# EasyEDA Pro project ProPrj_Summer Robot_2025-12-26-22-22-15.epro

# Schematic Motor Control Unit
Board Name: Motor Control Unit; Create Date: 2025-05-18; Page Name: P1; Project Name: Summer Robot; Schematic Name: Motor Control Unit; Update Date: 2025-05-18; Company: Ethan Reynolds; Drawn: 2025-05-17; Page Size: A4; Version: V1.0
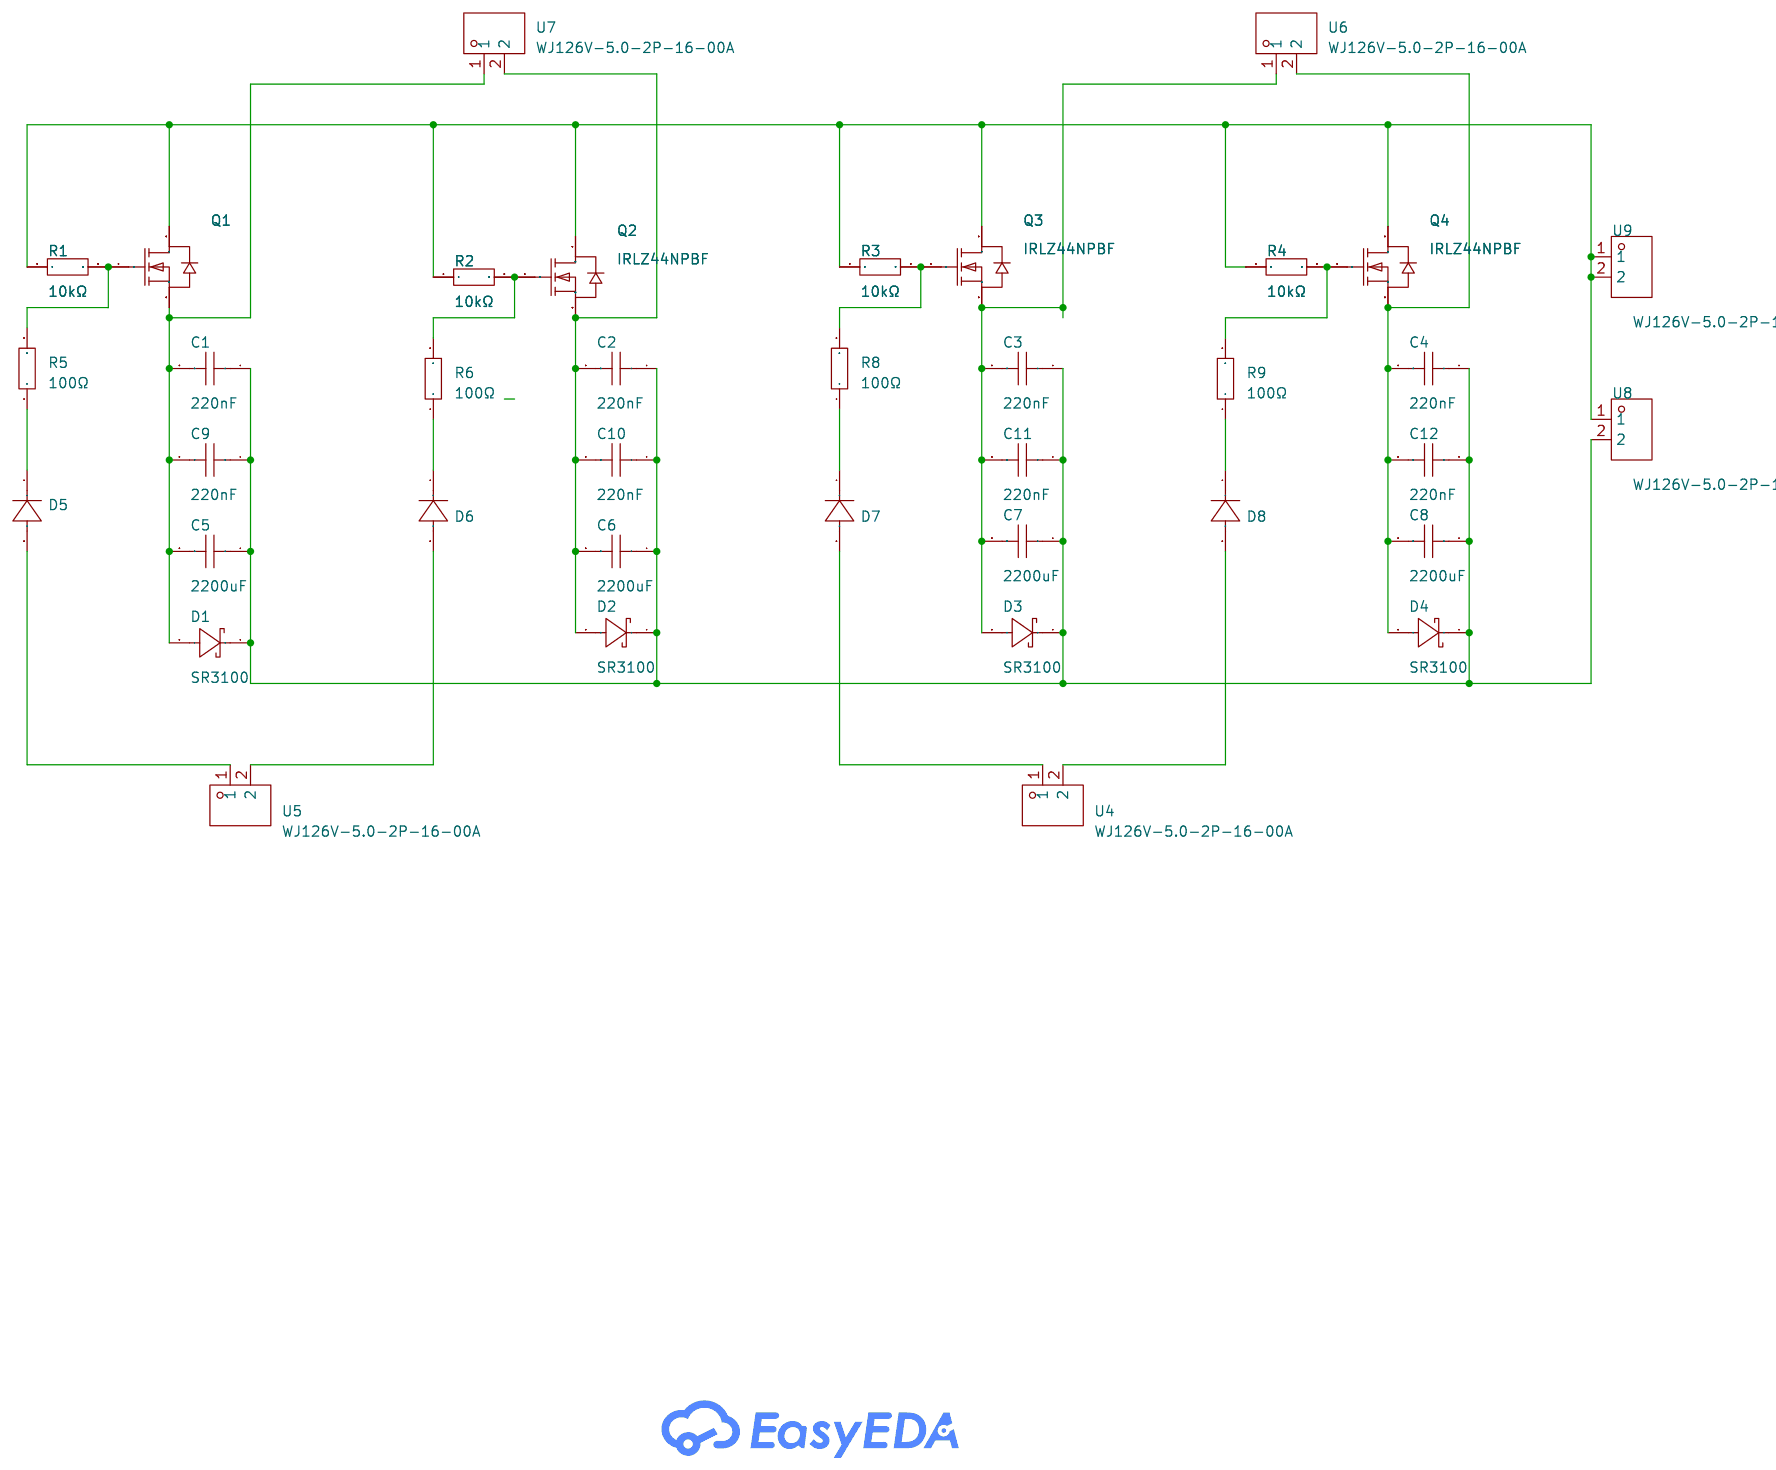
[diagram p0: schematic sheet]

## Parts
C1  220nF  [CAP-TH_L10.0-W2.7-P7.80-D0.4]
C2  220nF  [CAP-TH_L10.0-W2.7-P7.80-D0.4]
C3  220nF  [CAP-TH_L10.0-W2.7-P7.80-D0.4]
C4  220nF  [CAP-TH_L10.0-W2.7-P7.80-D0.4]
C5  2200uF  [CAP-TH_BD10.0-P5.00-D0.6-FD]
C6  2200uF  [CAP-TH_BD10.0-P5.00-D0.6-FD]
C7  2200uF  [CAP-TH_BD10.0-P5.00-D0.6-FD]
C8  2200uF  [CAP-TH_BD10.0-P5.00-D0.6-FD]
C9  220nF  [CAP-TH_L10.0-W2.7-P7.80-D0.4]
C10  220nF  [CAP-TH_L10.0-W2.7-P7.80-D0.4]
C11  220nF  [CAP-TH_L10.0-W2.7-P7.80-D0.4]
C12  220nF  [CAP-TH_L10.0-W2.7-P7.80-D0.4]
D1  SR3100  [DO-201AD_BD5.3-L8.4-P12.50-D1.4-RD]
D2  SR3100  [DO-201AD_BD5.3-L8.4-P12.50-D1.4-RD]
D3  SR3100  [DO-201AD_BD5.3-L8.4-P12.50-D1.4-RD]
D4  SR3100  [DO-201AD_BD5.3-L8.4-P12.50-D1.4-RD]
D5  -  [DO-41_BD2.4-L4.7-P8.70-D0.9-RD]
D6  -  [DO-41_BD2.4-L4.7-P8.70-D0.9-RD]
D7  -  [DO-41_BD2.4-L4.7-P8.70-D0.9-RD]
D8  -  [DO-41_BD2.4-L4.7-P8.70-D0.9-RD]
Q1  IRLZ44NPBF  [TO-220-3_L10.0-W4.5-P2.54-T]
Q2  IRLZ44NPBF  [TO-220-3_L10.0-W4.5-P2.54-T]
Q3  IRLZ44NPBF  [TO-220-3_L10.0-W4.5-P2.54-T]
Q4  IRLZ44NPBF  [TO-220-3_L10.0-W4.5-P2.54-T]
R1  10kΩ  [RES-TH_BD2.4-L6.3-P10.30-D0.6]
R2  10kΩ  [RES-TH_BD2.4-L6.3-P10.30-D0.6]
R3  10kΩ  [RES-TH_BD2.4-L6.3-P10.30-D0.6]
R4  10kΩ  [RES-TH_BD2.4-L6.3-P10.30-D0.6]
R5  100Ω  [RES-TH_BD4.0-L11.5-P15.50-D0.7]
R6  100Ω  [RES-TH_BD4.0-L11.5-P15.50-D0.7]
R8  100Ω  [RES-TH_BD4.0-L11.5-P15.50-D0.7]
R9  100Ω  [RES-TH_BD4.0-L11.5-P15.50-D0.7]
U4  WJ126V-5.0-2P-16-00A  [CONN-TH_WJ126V-5.0-2P]
U5  WJ126V-5.0-2P-16-00A  [CONN-TH_WJ126V-5.0-2P]
U6  WJ126V-5.0-2P-16-00A  [CONN-TH_WJ126V-5.0-2P]
U7  WJ126V-5.0-2P-16-00A  [CONN-TH_WJ126V-5.0-2P]
U8  WJ126V-5.0-2P-16-00A  [CONN-TH_WJ126V-5.0-2P]
U9  WJ126V-5.0-2P-16-00A  [CONN-TH_WJ126V-5.0-2P]

## Library data of the parts
C1-C4 C9-C12 = MPE224J100V82CL0045: Capacitance:220nF Tolerance:±5% Tolerance:±5% Voltage Rated: Dielectric Material:Metallized Polyester Operating Temperature:-55℃~+85℃ Operating Temperature:-55℃~+85℃; LCSC Part Name: 220nF ±5% 100V; Supplier Part: C2803185; Manufacturer: KNSCHA(科尼盛); Supplier Footprint: 插件,P=5mm; JLCPCB Part Class: Extended Part; Datasheet: https://atta.szlcsc.com/upload/public/pdf/source/20210420/C2803185_E3321C8762E86646BB5DB6CDE5AB9948.pdf; Supplier: LCSC; Tolerance: ±5%; Dielectric Material: Metallized Polyester; Operating Temperature: -55℃~+85℃
C5-C8 = EKZE160ELL222MJ25S: Capacitance: Tolerance:±20% Tolerance:±20% Rated Voltage: Ripple Current:- Equivalent Series Resistance(ESR):- Lead Spacing: φD: L: Lifetime @ Temp:5000hrs@105℃; LCSC Part Name: 2200uF ±20% 16V; Supplier Part: C320010; Manufacturer: NCC(日本贵弥功); Supplier Footprint: 插件,D10xL25mm; JLCPCB Part Class: Extended Part; Datasheet: https://atta.szlcsc.com/upload/public/pdf/source/20190311/C320010_4ADC44D1D3213EF7D3C5B91987F675CC.pdf; Supplier: LCSC; Tolerance: ±20%; Lifetime @ Temp: 5000hrs@105℃
D1-D4 = SR3100_C698900: Diode Configuration:Independent Type Voltage - Forward(Vf@If):850mV@3A Voltage - DC Reverse(Vr):100V Current - Rectified:3A Reverse Leakage Current (Ir):100uA@100V; LCSC Part Name: 电压:100V 电流:3A; Supplier Part: C698900; Manufacturer: YANGJIE(扬杰); Supplier Footprint: DO-27; JLCPCB Part Class: Extended Part; Datasheet: https://atta.szlcsc.com/upload/public/pdf/source/20200709/C698900_6D78AD0DF45561612416347AC03E8208.pdf; Supplier: LCSC; Diode Configuration: Independent Type; Voltage - Forward(Vf@If): 850mV@3A; Voltage - DC Reverse(Vr): 100V; Current - Rectified: 3A; Reverse Leakage Current (Ir): 100uA@100V
D5-D8 = 1N4007: Supplier Footprint: DO-41
Q1-Q4 = IRLZ44NPBF: Type:1 N-Channel Drain Source Voltage (Vdss): Continuous Drain Current (Id): Drain Source On Resistance (RDS(on)@Vgs,Id):0.025Ω@5.0V,25A Power Dissipation (Pd): Gate Threshold Voltage (Vgs(th)@Id):1V@250uA Total Gate Charge (Qg@Vgs):48nC Input Capacitance; LCSC Part Name: 1个N沟道 耐压:55V 电流:47A; Supplier Part: C38774; Manufacturer: Infineon(英飞凌); Supplier Footprint: TO-220AB; JLCPCB Part Class: Extended Part; Datasheet: https://atta.szlcsc.com/upload/public/pdf/source/20141125/1457707250505.pdf; Supplier: LCSC; Type: 1 N-Channel; Drain Source On Resistance (RDS(on)@Vgs,Id): 0.025Ω@5.0V,25A; Gate Threshold Voltage (Vgs(th)@Id): 1V@250uA; Total Gate Charge (Qg@Vgs): 48nC; Input Capacitance (Ciss@Vds): 1.7nF; Reverse Transfer Capacitance (Crss@Vds): 150pF; Operating Temperature: -55℃~+175℃
R1-R4 = RN1/4W10KFT/BA1: Type:Metal Film Resistors Resistance:10kΩ Tolerance:±1% Tolerance:±1% Voltage-Supply(Max):250V Power(Watts):1/4W Temperature Coefficient:±50ppm/℃ Temperature Coefficient:±50ppm/℃ Operating Temperature:-55℃~+125℃ Operating Temperature:-55℃~+125℃; LCSC Part Name: 10kΩ ±1% 250mW 金属膜电阻; Supplier Part: C410695; Manufacturer: Tyohm(幸亚电阻); Supplier Footprint: 插件,D2.4xL6.5mm; JLCPCB Part Class: Extended Part; Datasheet: https://atta.szlcsc.com/upload/public/pdf/source/20250211/2C0505E212032D72CE625B2E6B5197BA.pdf; Supplier: LCSC; Type: Metal Film Resistors; Tolerance: ±1%; Voltage-Supply(Max): 250V; Power(Watts): 1/4W; Temperature Coefficient: ±50ppm/℃; Operating Temperature: -55℃~+125℃
R5 R6 R8 R9 = MF1W-100Ω±1% T: Type:Metal Film Resistors Resistance: Tolerance:±1% Tolerance:±1% Voltage-Supply(Max):350V Power(Watts):1W Temperature Coefficient:±100ppm/℃ Temperature Coefficient:±100ppm/℃ Operating Temperature:-55℃~+155℃ Operating Temperature:-55℃~+155℃; LCSC Part Name: 100Ω ±1% 1W 金属膜电阻; Supplier Part: C119469; Manufacturer: CCO(千志电子); Supplier Footprint: 插件,D4.5xL11.5mm; JLCPCB Part Class: Extended Part; Datasheet: https://atta.szlcsc.com/upload/public/pdf/source/20190910/C427326_62A6D058BC0FF74963A2F22379CA06CE.pdf; Supplier: LCSC; Type: Metal Film Resistors; Tolerance: ±1%; Voltage-Supply(Max): 350V; Power(Watts): 1W; Temperature Coefficient: ±100ppm/℃; Operating Temperature: -55℃~+155℃
U4-U9 = WJ126V-5.0-2P-16-00A: LCSC Part Name: 直插式/5.0mm 2P 红色; Supplier Part: C3031437; Manufacturer: KANGNEX(康奈克斯电气); Supplier Footprint: P=5mm; JLCPCB Part Class: Extended Part; Datasheet: https://atta.szlcsc.com/upload/public/pdf/source/20191225/C8379_3D37D98EF6F0ECCD8D2EB72C93E46299.pdf; Supplier: LCSC

## Nets
$1N1159: Q1.2(D) Q2.2(D) Q3.2(D) Q4.2(D) R1.1 R2.1 R3.1 R4.1 U8.1 U9.1 U9.2
$1N1315: Q4.1(G) R4.2 R9.2
$1N1376: D8.1(K) R9.1
$1N1382: Q3.1(G) R3.2 R8.2
$1N1384: Q2.1(G) R2.2 R6.2
$1N1386: Q1.1(G) R1.2 R5.2
$1N1420: C4.2 C8.2 C12.2 D4.2(A) Q4.3(S) U6.2
$1N1432: D8.2(A) U4.2
$1N1435: C3.2 C7.2 C11.2 D3.2(A) Q3.3(S) U6.1
$1N1443: D7.1(K) R8.1
$1N1558: C2.2 C6.2 C10.2 D2.2(A) Q2.3(S) U7.2
$1N1571: D6.1(K) R6.1
$1N1599: C1.2 C5.2 C9.2 D1.2(A) Q1.3(S) U7.1
$1N1611: D5.1(K) R5.1
$1N2155: D5.2(A) U5.1
$1N2160: D6.2(A) U5.2
$1N2166: D7.2(A) U4.1
$1N6815: C1.1 C2.1 C3.1 C4.1 C5.1 C6.1 C7.1 C8.1 C9.1 C10.1 C11.1 C12.1 D1.1(K) D2.1(K) D3.1(K) D4.1(K) U8.2

# Schematic Relay Driver Unit
Board Name: Relay Driver Unit; Create Date: 2025-05-18; Page Name: P1; Project Name: Summer Robot; Schematic Name: Relay Driver Unit; Update Date: 2025-05-18; Company: EasyEDA.com; Page Size: A4; Version: V1.0
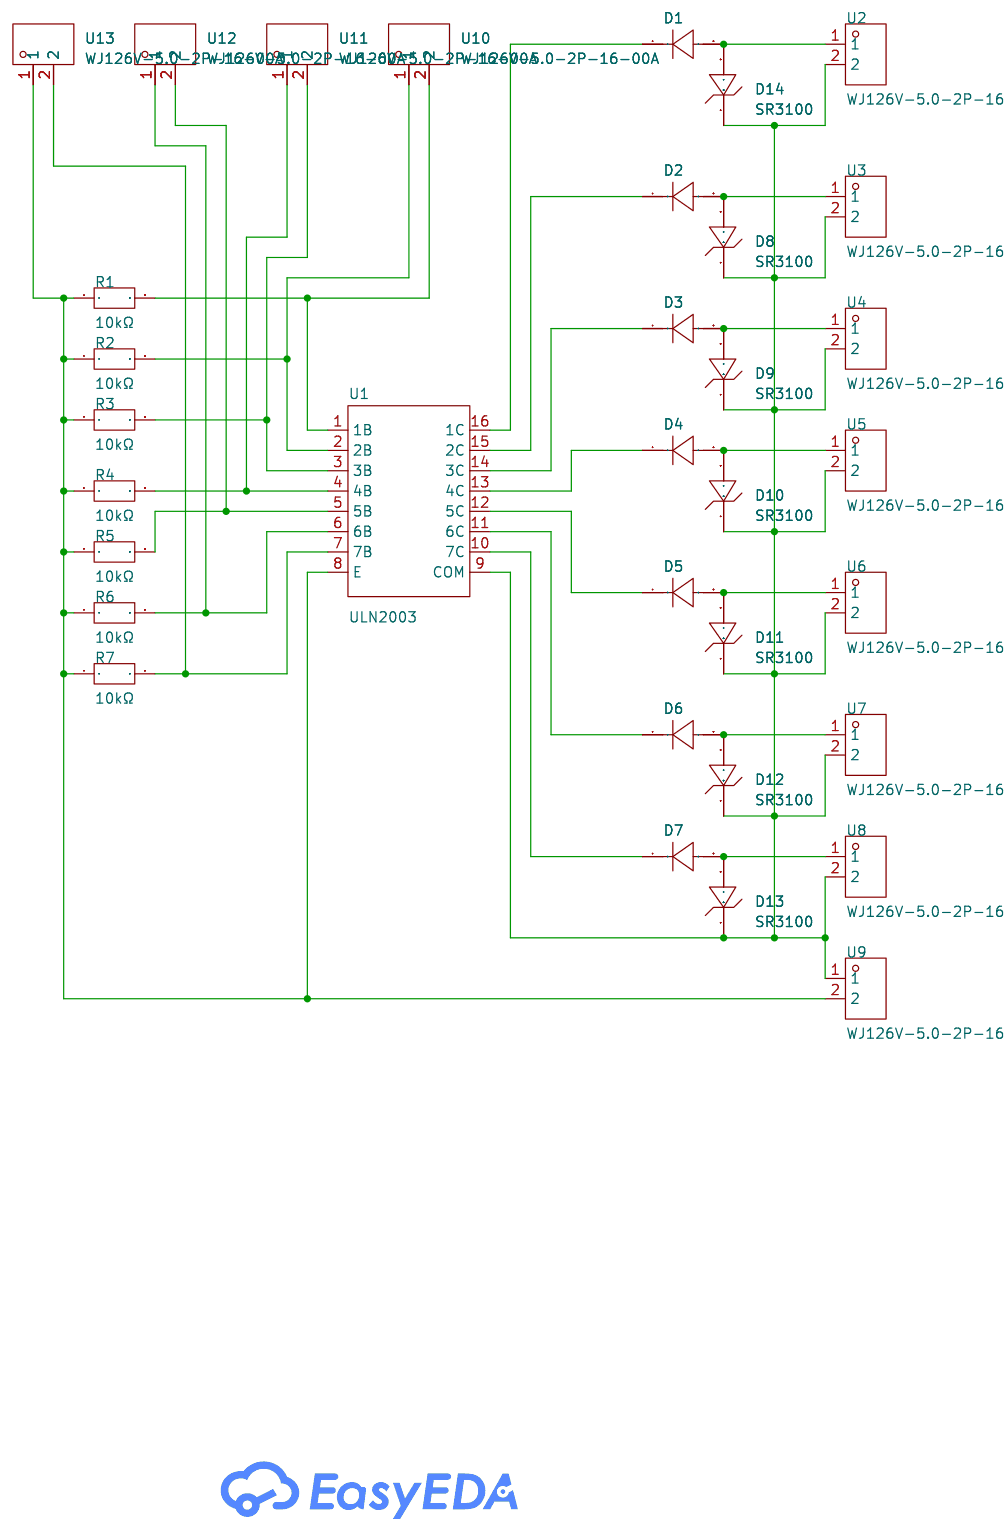
[diagram p1: schematic sheet]

## Parts
D1  -  [DO-41_BD2.4-L4.7-P8.70-D0.9-RD]
D2  -  [DO-41_BD2.4-L4.7-P8.70-D0.9-RD]
D3  -  [DO-41_BD2.4-L4.7-P8.70-D0.9-RD]
D4  -  [DO-41_BD2.4-L4.7-P8.70-D0.9-RD]
D5  -  [DO-41_BD2.4-L4.7-P8.70-D0.9-RD]
D6  -  [DO-41_BD2.4-L4.7-P8.70-D0.9-RD]
D7  -  [DO-41_BD2.4-L4.7-P8.70-D0.9-RD]
D8  SR3100  [DO-27_BD5.2-L8.9-P12.90-D1.5-RD]
D9  SR3100  [DO-27_BD5.2-L8.9-P12.90-D1.5-RD]
D10  SR3100  [DO-27_BD5.2-L8.9-P12.90-D1.5-RD]
D11  SR3100  [DO-27_BD5.2-L8.9-P12.90-D1.5-RD]
D12  SR3100  [DO-27_BD5.2-L8.9-P12.90-D1.5-RD]
D13  SR3100  [DO-27_BD5.2-L8.9-P12.90-D1.5-RD]
D14  SR3100  [DO-27_BD5.2-L8.9-P12.90-D1.5-RD]
R1  10kΩ  [RES-TH_BD2.4-L6.3-P10.30-D0.6]
R2  10kΩ  [RES-TH_BD2.4-L6.3-P10.30-D0.6]
R3  10kΩ  [RES-TH_BD2.4-L6.3-P10.30-D0.6]
R4  10kΩ  [RES-TH_BD2.4-L6.3-P10.30-D0.6]
R5  10kΩ  [RES-TH_BD2.4-L6.3-P10.30-D0.6]
R6  10kΩ  [RES-TH_BD2.4-L6.3-P10.30-D0.6]
R7  10kΩ  [RES-TH_BD2.4-L6.3-P10.30-D0.6]
U1  ULN2003  [DIP-16_L19.2-W6.6-P2.54-LS7.6-BL]
U2  WJ126V-5.0-2P-16-00A  [CONN-TH_WJ126V-5.0-2P]
U3  WJ126V-5.0-2P-16-00A  [CONN-TH_WJ126V-5.0-2P]
U4  WJ126V-5.0-2P-16-00A  [CONN-TH_WJ126V-5.0-2P]
U5  WJ126V-5.0-2P-16-00A  [CONN-TH_WJ126V-5.0-2P]
U6  WJ126V-5.0-2P-16-00A  [CONN-TH_WJ126V-5.0-2P]
U7  WJ126V-5.0-2P-16-00A  [CONN-TH_WJ126V-5.0-2P]
U8  WJ126V-5.0-2P-16-00A  [CONN-TH_WJ126V-5.0-2P]
U9  WJ126V-5.0-2P-16-00A  [CONN-TH_WJ126V-5.0-2P]
U10  WJ126V-5.0-2P-16-00A  [CONN-TH_WJ126V-5.0-2P]
U11  WJ126V-5.0-2P-16-00A  [CONN-TH_WJ126V-5.0-2P]
U12  WJ126V-5.0-2P-16-00A  [CONN-TH_WJ126V-5.0-2P]
U13  WJ126V-5.0-2P-16-00A  [CONN-TH_WJ126V-5.0-2P]

## Library data of the parts
D1-D7 = 1N4007: Supplier Footprint: DO-41
D8-D14 = SR3100_C402291: Diode Configuration:Independent Type Voltage - Forward(Vf@If):850mV@3A Voltage - DC Reverse(Vr):100V Current - Rectified:3A Reverse Leakage Current (Ir):100uA@100V; LCSC Part Name: 电压:100V 电流:3A; Supplier Part: C402291; Manufacturer: LGE(鲁光); Supplier Footprint: DO-27; JLCPCB Part Class: Extended Part; Datasheet: https://atta.szlcsc.com/upload/public/pdf/source/20190705/C402293_92C4D8B797E3ECB762557B3141A428BE.pdf; Supplier: LCSC; Diode Configuration: Independent Type; Voltage - Forward(Vf@If): 850mV@3A; Voltage - DC Reverse(Vr): 100V; Current - Rectified: 3A; Reverse Leakage Current (Ir): 100uA@100V
R1-R7 = RN1/4W10KFT/BA1: Type:Metal Film Resistors Resistance:10kΩ Tolerance:±1% Tolerance:±1% Voltage-Supply(Max):250V Power(Watts):1/4W Temperature Coefficient:±50ppm/℃ Temperature Coefficient:±50ppm/℃ Operating Temperature:-55℃~+125℃ Operating Temperature:-55℃~+125℃; LCSC Part Name: 10kΩ ±1% 250mW 金属膜电阻; Supplier Part: C410695; Manufacturer: Tyohm(幸亚电阻); Supplier Footprint: 插件,D2.4xL6.5mm; JLCPCB Part Class: Extended Part; Datasheet: https://atta.szlcsc.com/upload/public/pdf/source/20250211/2C0505E212032D72CE625B2E6B5197BA.pdf; Supplier: LCSC; Type: Metal Film Resistors; Tolerance: ±1%; Voltage-Supply(Max): 250V; Power(Watts): 1/4W; Temperature Coefficient: ±50ppm/℃; Operating Temperature: -55℃~+125℃
U1 = ULN2003_C6851442: number of channels:Seven channels Maximum collector Emitter Voltage (Vceo):50V Collector Current(Ic):- maximum input voltage:30V Operating Temperature:- Operating Temperature:-; LCSC Part Name: 七路 Vceo: 50V 电压(VI): 30V; Supplier Part: C6851442; Manufacturer: HXY MOSFET(华轩阳电子); Supplier Footprint: SOP-16; JLCPCB Part Class: Extended Part; Datasheet: https://atta.szlcsc.com/upload/public/pdf/source/20230526/BF18AFD4628411B197E7B7E814422353.pdf; Supplier: LCSC; number of channels: Seven channels; Maximum collector Emitter Voltage (Vceo): 50V; maximum input voltage: 30V
U2-U13 = WJ126V-5.0-2P-16-00A: LCSC Part Name: 直插式/5.0mm 2P 红色; Supplier Part: C3031437; Manufacturer: KANGNEX(康奈克斯电气); Supplier Footprint: P=5mm; JLCPCB Part Class: Extended Part; Datasheet: https://atta.szlcsc.com/upload/public/pdf/source/20191225/C8379_3D37D98EF6F0ECCD8D2EB72C93E46299.pdf; Supplier: LCSC

## Nets
$1N276: D2.1(K) U1.15(2C)
$1N301: D3.1(K) U1.14(3C)
$1N326: D4.1(K) U1.13(4C)
$1N351: D5.1(K) U1.12(5C)
$1N376: D6.1(K) U1.11(6C)
$1N401: D7.1(K) U1.10(7C)
$1N426: D1.1(K) U1.16(1C)
$1N702: D1.2(A) D14.2(A) U2.1
$1N715: D2.2(A) D8.2(A) U3.1
$1N718: D3.2(A) D9.2(A) U4.1
$1N723: D4.2(A) D10.2(A) U5.1
$1N728: D5.2(A) D11.2(A) U6.1
$1N733: D7.2(A) D13.2(A) U8.1
$1N738: D6.2(A) D12.2(A) U7.1
$1N780: R1.2 U1.1(1B) U10.2
$1N819: R2.2 U1.2(2B) U10.1
$1N858: R3.2 U1.3(3B) U11.2
$1N897: R4.2 U1.4(4B) U11.1
$1N936: R5.2 U1.5(5B) U12.2
$1N975: R6.2 U1.6(6B) U12.1
$1N1014: R7.2 U1.7(7B) U13.2
$1N3496: D8.1(C) D9.1(C) D10.1(C) D11.1(C) D12.1(C) D13.1(C) D14.1(C) U1.9(COM) U2.2 U3.2 U4.2 U5.2 U6.2 U7.2 U8.2 U9.1
$1N3515: R1.1 R2.1 R3.1 R4.1 R5.1 R6.1 R7.1 U1.8(E) U9.2 U13.1

# Board PCB3
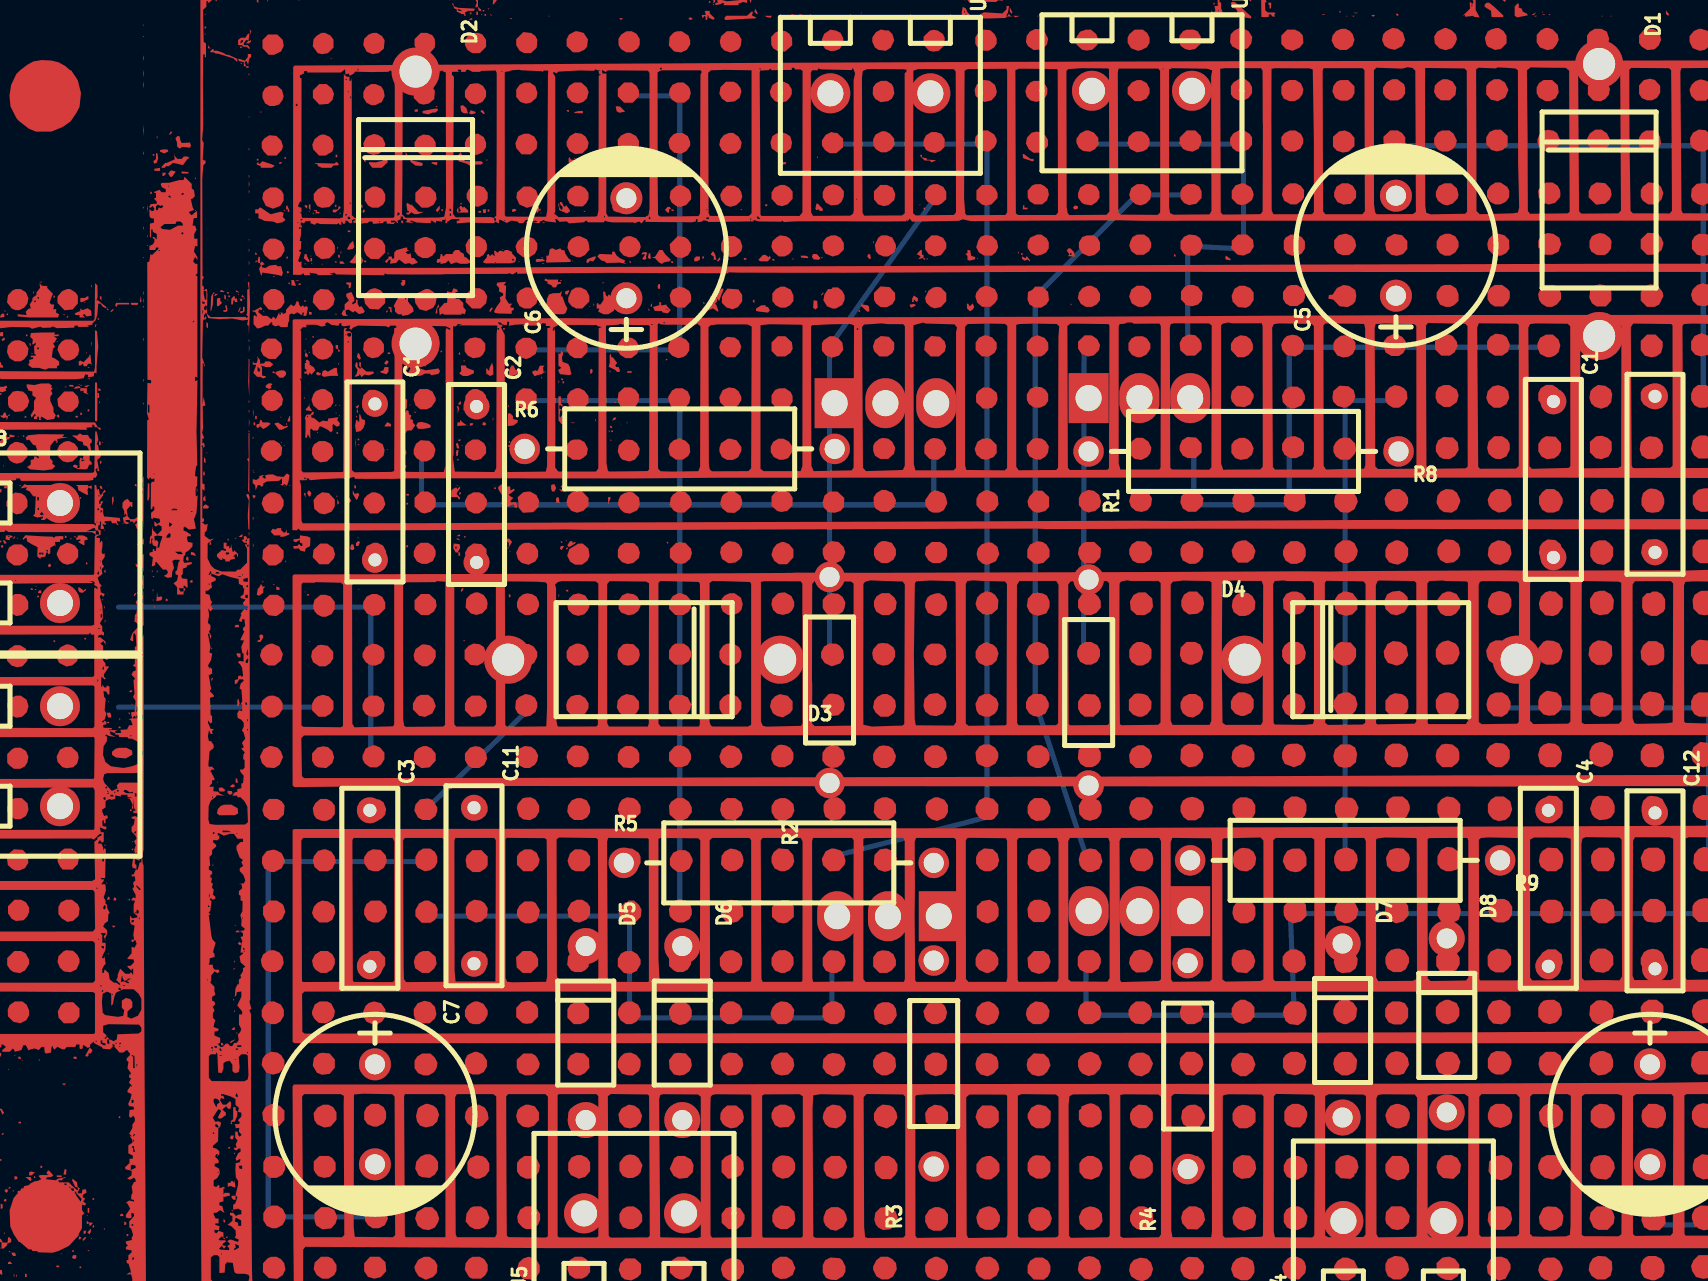
[diagram p2: board, top side]
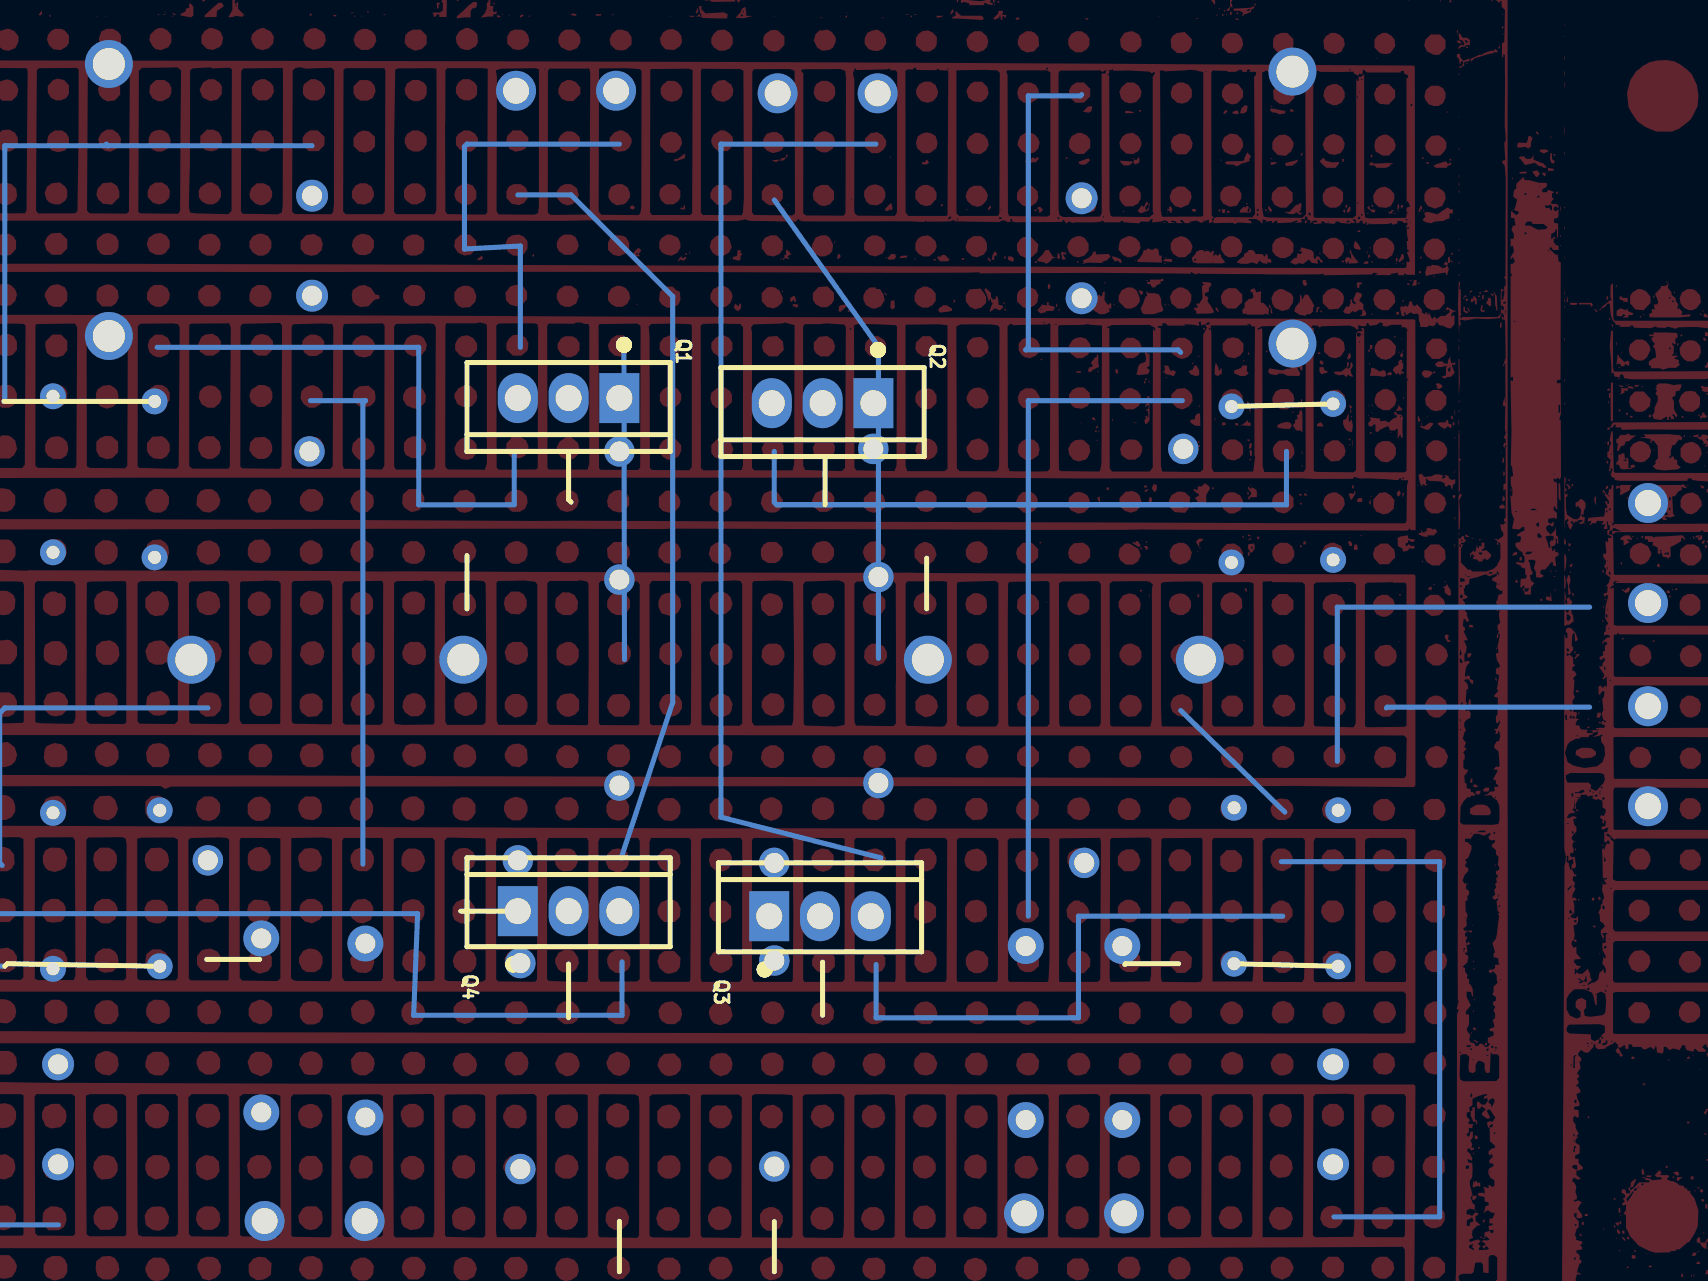
[diagram p3: board, bottom side, seen from below]

No outline. copper layers: Top Layer, Bottom Layer. Coordinates in mm from the lowest, leftmost part position.
Stack: Top Layer 0.035mm / Dielectric1 1.51mm FR4 er 4.5 / Bottom Layer 0.035mm

## Design rules (mm)
template: JLCPCB Capability(Two Layers Board)
spacing copperThickness1oz (default): track to track 0.102, other pairs 0.152 to 0.3
spacing copperThickness2oz: track to track 0.203, other pairs 0.152 to 0.3
track width copperThickness1oz (default): min 0.127, default 0.254, max 2.54
track width copperThickness2oz: min 0.203, default 0.254, max 2.54
differential pair differentialPair (default): width min 0.127, default 0.254, max 2.54; gap min 0.152, default 0.152
via viaSize (default): diameter min 0.5, default 0.61, max 10; hole min 0.3, default 0.305, max 6.3

## Placement (name value [footprint] x y rotation side)
C1  220nF  [CAP-TH_L10.0-W2.7-P7.80-D0.4]  74.68 37.08 270 top
C2  220nF  [CAP-TH_L10.0-W2.7-P7.80-D0.4]  20.83 36.83 270 top
C3  220nF  [CAP-TH_L10.0-W2.7-P7.80-D0.4]  15.49 16.64 270 top
C4  220nF  [CAP-TH_L10.0-W2.7-P7.80-D0.4]  74.42 16.64 270 top
C5  2200uF  [CAP-TH_BD10.0-P5.00-D0.6-FD]  66.8 48.77 90 top
C6  2200uF  [CAP-TH_BD10.0-P5.00-D0.6-FD]  28.32 48.64 90 top
C7  2200uF  [CAP-TH_BD10.0-P5.00-D0.6-FD]  15.75 5.33 270 top
C8  2200uF  [CAP-TH_BD10.0-P5.00-D0.6-FD]  79.5 5.33 270 top
C9  220nF  [CAP-TH_L10.0-W2.7-P7.80-D0.4]  79.76 37.34 270 top
C10  220nF  [CAP-TH_L10.0-W2.7-P7.80-D0.4]  15.75 36.96 270 top
C11  220nF  [CAP-TH_L10.0-W2.7-P7.80-D0.4]  20.7 16.76 270 top
C12  220nF  [CAP-TH_L10.0-W2.7-P7.80-D0.4]  79.76 16.51 270 top
D1  SR3100  [DO-201AD_BD5.3-L8.4-P12.50-D1.4-RD]  76.96 51.05 270 top
D2  SR3100  [DO-201AD_BD5.3-L8.4-P12.50-D1.4-RD]  17.78 50.67 270 top
D3  SR3100  [DO-201AD_BD5.3-L8.4-P12.50-D1.4-RD]  29.21 28.07 180 top
D4  SR3100  [DO-201AD_BD5.3-L8.4-P12.50-D1.4-RD]  66.04 28.07 0 top
D5  -  [DO-41_BD2.4-L4.7-P8.70-D0.9-RD]  26.29 9.4 270 top
D6  -  [DO-41_BD2.4-L4.7-P8.70-D0.9-RD]  31.12 9.4 270 top
D7  -  [DO-41_BD2.4-L4.7-P8.70-D0.9-RD]  64.14 9.52 270 top
D8  -  [DO-41_BD2.4-L4.7-P8.70-D0.9-RD]  69.34 9.78 270 top
Q1  IRLZ44NPBF  [TO-220-3_L10.0-W4.5-P2.54-T]  53.97 41.15 270 bottom
Q2  IRLZ44NPBF  [TO-220-3_L10.0-W4.5-P2.54-T]  41.28 40.89 270 bottom
Q3  IRLZ44NPBF  [TO-220-3_L10.0-W4.5-P2.54-T]  41.4 15.24 90 bottom
Q4  IRLZ44NPBF  [TO-220-3_L10.0-W4.5-P2.54-T]  53.97 15.49 90 bottom
R1  10kΩ  [RES-TH_BD2.4-L6.3-P10.30-D0.6]  51.44 26.92 270 top
R2  10kΩ  [RES-TH_BD2.4-L6.3-P10.30-D0.6]  38.48 27.05 90 top
R3  10kΩ  [RES-TH_BD2.4-L6.3-P10.30-D0.6]  43.69 7.87 90 top
R4  10kΩ  [RES-TH_BD2.4-L6.3-P10.30-D0.6]  56.39 7.75 90 top
R5  100Ω  [RES-TH_BD4.0-L11.5-P15.50-D0.7]  35.94 17.91 0 top
R6  100Ω  [RES-TH_BD4.0-L11.5-P15.50-D0.7]  30.99 38.61 0 top
R8  100Ω  [RES-TH_BD4.0-L11.5-P15.50-D0.7]  59.18 38.48 180 top
R9  100Ω  [RES-TH_BD4.0-L11.5-P15.50-D0.7]  64.26 18.03 180 top
U4  WJ126V-5.0-2P-16-00A  [CONN-TH_WJ126V-5.0-2P]  66.68 0 90 top
U5  WJ126V-5.0-2P-16-00A  [CONN-TH_WJ126V-5.0-2P]  28.7 0.38 90 top
U6  WJ126V-5.0-2P-16-00A  [CONN-TH_WJ126V-5.0-2P]  54.1 56.51 270 top
U7  WJ126V-5.0-2P-16-00A  [CONN-TH_WJ126V-5.0-2P]  41.02 56.39 270 top
U8  WJ126V-5.0-2P-16-00A  [CONN-TH_WJ126V-5.0-2P]  0 33.4 0 top
U9  WJ126V-5.0-2P-16-00A  [CONN-TH_WJ126V-5.0-2P]  0 23.24 0 top

## Footprints (pads in the part's own frame, mm; a bottom-side part is the same pattern mirrored in y, then rotated)
CAP-TH_BD10.0-P5.00-D0.6-FD
  round 1.6 hole 1: 1(-2.5,0) 2(2.5,0)
CAP-TH_L10.0-W2.7-P7.80-D0.4
  round 1.3 hole 0.65: 1(-3.9,0) 2(3.9,0)
CONN-TH_WJ126V-5.0-2P
  round 2 hole 1.3: 1(0,2.501) 2(0,-2.501)
DO-41_BD2.4-L4.7-P8.70-D0.9-RD
  round 1.8 hole 1: 1(-4.35,0) 2(4.35,0)
DO-201AD_BD5.3-L8.4-P12.50-D1.4-RD
  round 2.4 hole 1.6: 1(-6.8,0) 2(6.8,0)
RES-TH_BD2.4-L6.3-P10.30-D0.6
  round 1.524 hole 1: 1(-5.15,0) 2(5.15,0)
RES-TH_BD4.0-L11.5-P15.50-D0.7
  round 1.524 hole 1: 1(-7.75,0) 2(7.75,0)
TO-220-3_L10.0-W4.5-P2.54-T
  rect 2.5x2 hole 1.3: 1(0,2.54)
  oval 2.5x2 hole 1.3: 2(0,0) 3(0,-2.54)

## Nets
As in the schematic.

## Routing (per net, layer and track width the routed paths; a pad name or vN(x,y) marks a point on that pad's centre or on a via; arc(x,y) is an arc through that point)
$1N1159: length 20.3
  Bottom Layer w0.254: 2.92,30.69 15.54,30.69 15.54,22.99
$1N1382: length 44.1
  Bottom Layer w0.254: 51.18,28.08 51.21,43.81 ; 56.69,38.48 56.69,35.81 61.47,35.81 61.47,43.69 74.55,43.69
$1N1384: length 18.1
  Bottom Layer w0.254: 38.48,28.13 38.48,43.56 ; 43.57,35.81 43.69,35.94 43.69,38.48
$1N1571: length 48.4
  Bottom Layer w0.254: 18.08,38.48 18.08,35.81 43.57,35.81 23.29,35.81
$1N6815: length 10.2
  Bottom Layer w0.254: 2.92,25.69 13.04,25.69 13.08,25.65

Small or netless copper shapes (teardrops, artwork), in the pictures only: 1724 on Top Layer

# Board PCB4
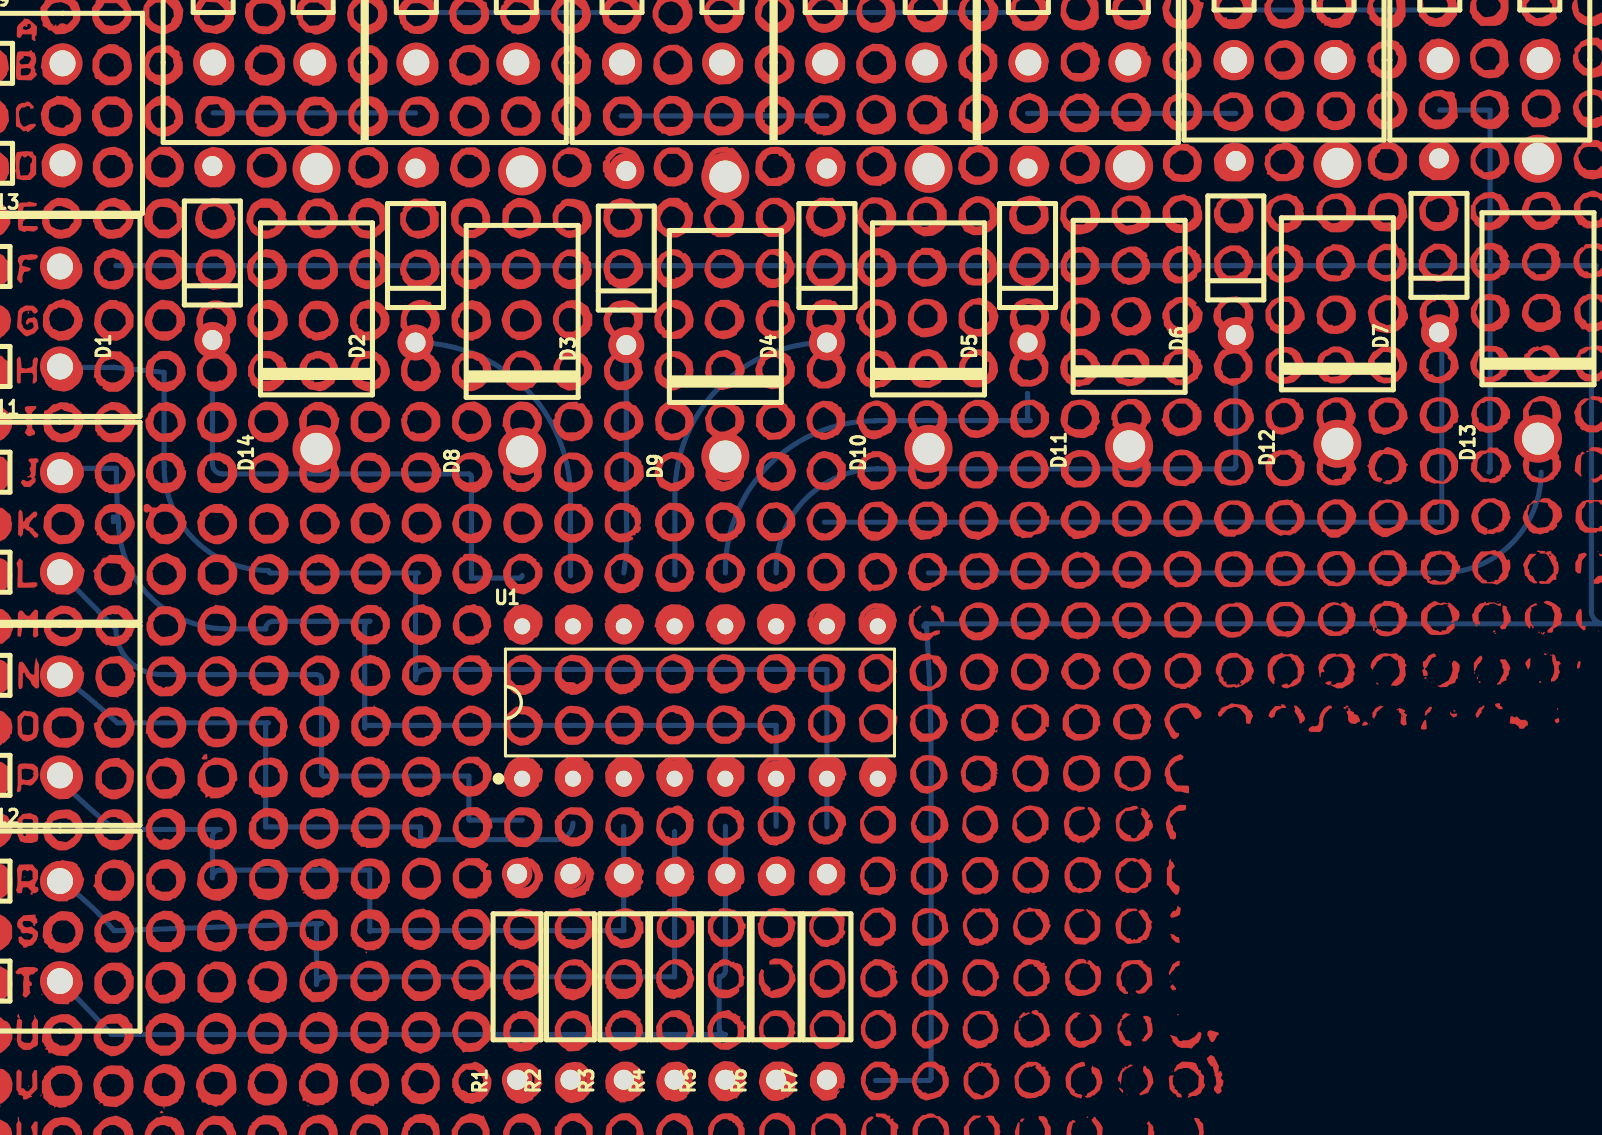
[diagram p4: board, top side]
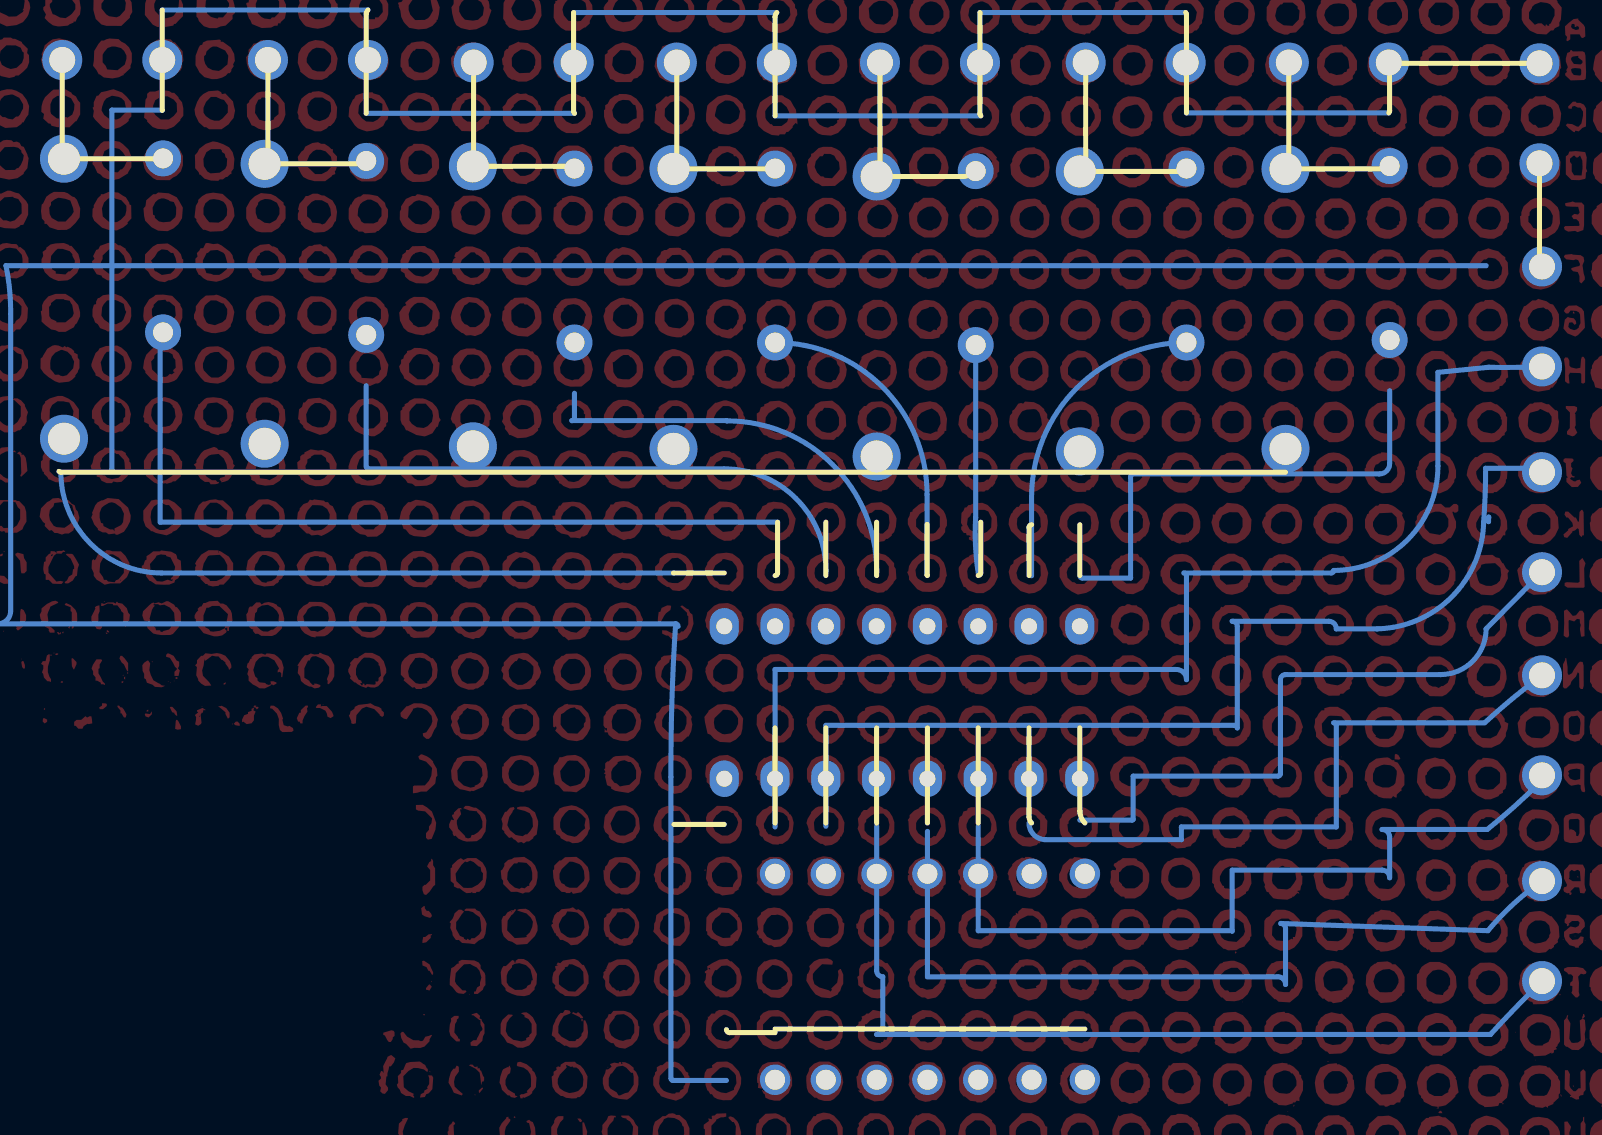
[diagram p5: board, bottom side, seen from below]

No outline. copper layers: Top Layer, Bottom Layer. Coordinates in mm from the lowest, leftmost part position.
Stack: Top Layer 0.035mm / Dielectric1 1.51mm FR4 er 4.5 / Bottom Layer 0.035mm

## Design rules (mm)
template: JLCPCB Capability(Two Layers Board)
spacing copperThickness1oz (default): track to track 0.102, other pairs 0.152 to 0.3
spacing copperThickness2oz: track to track 0.203, other pairs 0.152 to 0.3
track width copperThickness1oz (default): min 0.127, default 0.254, max 2.54
track width copperThickness2oz: min 0.203, default 0.254, max 2.54
differential pair differentialPair (default): width min 0.127, default 0.254, max 2.54; gap min 0.152, default 0.152
via viaSize (default): diameter min 0.5, default 0.61, max 10; hole min 0.3, default 0.305, max 6.3

## Placement (name value [footprint] x y rotation side)
D1  -  [DO-41_BD2.4-L4.7-P8.70-D0.9-RD]  7.62 36.19 90 top
D2  -  [DO-41_BD2.4-L4.7-P8.70-D0.9-RD]  17.78 36.07 90 top
D3  -  [DO-41_BD2.4-L4.7-P8.70-D0.9-RD]  28.32 35.94 90 top
D4  -  [DO-41_BD2.4-L4.7-P8.70-D0.9-RD]  38.35 36.07 90 top
D5  -  [DO-41_BD2.4-L4.7-P8.70-D0.9-RD]  48.39 36.07 90 top
D6  -  [DO-41_BD2.4-L4.7-P8.70-D0.9-RD]  58.8 36.45 90 top
D7  -  [DO-41_BD2.4-L4.7-P8.70-D0.9-RD]  68.96 36.58 90 top
D8  SR3100  [DO-27_BD5.2-L8.9-P12.90-D1.5-RD]  23.11 33.27 90 top
D9  SR3100  [DO-27_BD5.2-L8.9-P12.90-D1.5-RD]  33.27 33.02 90 top
D10  SR3100  [DO-27_BD5.2-L8.9-P12.90-D1.5-RD]  43.43 33.4 90 top
D11  SR3100  [DO-27_BD5.2-L8.9-P12.90-D1.5-RD]  53.47 33.53 90 top
D12  SR3100  [DO-27_BD5.2-L8.9-P12.90-D1.5-RD]  63.88 33.65 90 top
D13  SR3100  [DO-27_BD5.2-L8.9-P12.90-D1.5-RD]  73.91 33.91 90 top
D14  SR3100  [DO-27_BD5.2-L8.9-P12.90-D1.5-RD]  12.83 33.4 90 top
R1  10kΩ  [RES-TH_BD2.4-L6.3-P10.30-D0.6]  22.86 0 90 top
R2  10kΩ  [RES-TH_BD2.4-L6.3-P10.30-D0.6]  25.53 0 90 top
R3  10kΩ  [RES-TH_BD2.4-L6.3-P10.30-D0.6]  28.19 0 90 top
R4  10kΩ  [RES-TH_BD2.4-L6.3-P10.30-D0.6]  30.73 0 90 top
R5  10kΩ  [RES-TH_BD2.4-L6.3-P10.30-D0.6]  33.27 0 90 top
R6  10kΩ  [RES-TH_BD2.4-L6.3-P10.30-D0.6]  35.81 0 90 top
R7  10kΩ  [RES-TH_BD2.4-L6.3-P10.30-D0.6]  38.35 0 90 top
U1  ULN2003  [DIP-16_L19.2-W6.6-P2.54-LS7.6-BL]  32 13.72 0 top
U2  WJ126V-5.0-2P-16-00A  [CONN-TH_WJ126V-5.0-2P]  10.16 45.72 270 top
U3  WJ126V-5.0-2P-16-00A  [CONN-TH_WJ126V-5.0-2P]  20.32 45.72 270 top
U4  WJ126V-5.0-2P-16-00A  [CONN-TH_WJ126V-5.0-2P]  30.61 45.72 270 top
U5  WJ126V-5.0-2P-16-00A  [CONN-TH_WJ126V-5.0-2P]  40.77 45.72 270 top
U6  WJ126V-5.0-2P-16-00A  [CONN-TH_WJ126V-5.0-2P]  50.93 45.72 270 top
U7  WJ126V-5.0-2P-16-00A  [CONN-TH_WJ126V-5.0-2P]  61.21 45.85 270 top
U8  WJ126V-5.0-2P-16-00A  [CONN-TH_WJ126V-5.0-2P]  71.5 45.85 270 top
U9  WJ126V-5.0-2P-16-00A  [CONN-TH_WJ126V-5.0-2P]  0.13 43.18 0 top
U10  WJ126V-5.0-2P-16-00A  [CONN-TH_WJ126V-5.0-2P]  0 12.57 0 top
U11  WJ126V-5.0-2P-16-00A  [CONN-TH_WJ126V-5.0-2P]  0 22.73 0 top
U12  WJ126V-5.0-2P-16-00A  [CONN-TH_WJ126V-5.0-2P]  0 2.29 0 top
U13  WJ126V-5.0-2P-16-00A  [CONN-TH_WJ126V-5.0-2P]  0 33.02 0 top

## Footprints (pads in the part's own frame, mm; a bottom-side part is the same pattern mirrored in y, then rotated)
CONN-TH_WJ126V-5.0-2P
  round 2 hole 1.3: 1(0,2.501) 2(0,-2.501)
DIP-16_L19.2-W6.6-P2.54-LS7.6-BL
  oval 1.46x1.825 hole 0.8: 1(-8.89,-3.81) 2(-6.35,-3.81) 3(-3.81,-3.81) 4(-1.27,-3.81) 5(1.27,-3.81) 6(3.81,-3.81) 7(6.35,-3.81) 8(8.89,-3.81) 9(8.89,3.81) 10(6.35,3.81) 11(3.81,3.81) 12(1.27,3.81) 13(-1.27,3.81) 14(-3.81,3.81) 15(-6.35,3.81) 16(-8.89,3.81)
DO-27_BD5.2-L8.9-P12.90-D1.5-RD
  round 2.4 hole 1.6: 1(-7,0) 2(7,0)
DO-41_BD2.4-L4.7-P8.70-D0.9-RD
  round 1.8 hole 1: 1(-4.35,0) 2(4.35,0)
RES-TH_BD2.4-L6.3-P10.30-D0.6
  round 1.524 hole 1: 1(-5.15,0) 2(5.15,0)

## Nets
As in the schematic.

## Routing (per net, layer and track width the routed paths; a pad name or vN(x,y) marks a point on that pad's centre or on a via; arc(x,y) is an arc through that point)
$1N276: length 16.1
  Bottom Layer w0.254: 17.78,31.72 arc(23.26,29.45) 25.53,23.97 25.53,20.05
$1N301: length 11.4
  Bottom Layer w0.254: D3.1 28.32,22.99 arc(28.33,21.59) 28.19,20.19
$1N326: length 16
  Bottom Layer w0.254: 30.75,20.1 30.75,24.12 arc(32.98,29.49) 38.35,31.72
$1N376: length 30.1
  Bottom Layer w0.254: 35.81,20.19 35.81,20.32 arc(37.3,23.91) 40.89,25.4 58.67,25.4 arc(58.76,25.44) 58.8,25.53 58.8,29.56
$1N401: length 40.5
  Bottom Layer w0.254: 38.23,22.73 69.1,22.73 69.1,32.31 arc(69.12,32.35) 69.15,32.36
$1N426: length 24.7
  Bottom Layer w0.254: 7.62,29.3 7.62,25.65 arc(7.77,25.29) 8.13,25.15 20.45,25.15 arc(20.54,25.11) 20.57,25.02 20.57,19.94 22.99,19.94 arc(23.08,19.98) 23.11,20.07
$1N819: length 33
  Bottom Layer w0.254: U10.1 arc(1.47,13.92) 2.87,12.7 10.41,12.7 arc(10.32,12.66) 10.29,12.57 10.29,7.49 18.03,7.49 18.03,6.86 24.83,6.86 arc(25.41,7.1) 25.65,7.68
$1N858: length 73.3
  Bottom Layer w0.254: 0.01,20.22 U11.2 arc(0.01,20.24) 0.02,20.24 arc(0.02,20.23) 0.01,20.22 ; 0.01,20.22 arc(0,20.22) 0,20.23 ; 0.01,20.22 2.79,17.4 arc(3.46,15.78) 5.08,15.11 12.83,15.11 arc(13.01,15.04) 13.08,14.86 13.08,10.16 arc(13.12,10.07) 13.21,10.03 20.45,10.03 20.45,7.87 arc(20.46,7.85) 20.49,7.83 23.11,7.83 ; 0.08,9.74 arc(1.38,8.52) 2.74,7.37 8,7.37 arc(7.73,7.25) 7.62,6.98 7.62,4.95 arc(7.73,5.22) 8,5.33 15.49,5.33 15.49,2.29 arc(15.5,2.3) 15.51,2.3 28.19,2.3 28.19,7.53
$1N897: length 42.6
  Bottom Layer w0.254: 0,4.79 arc(1.44,3.64) 2.7,2.3 13.06,2.67 arc(12.9,2.59) 12.83,2.41 12.83,-0.38 arc(12.94,-0.11) 13.21,0 30.73,0 30.73,7.27
$1N936: length 45.2
  Bottom Layer w0.254: U12.2 arc(1.31,-1.53) 2.58,-2.89 33.27,-2.89 arc(33.06,-2.8) 32.97,-2.58 32.97,0 arc(33.18,0.09) 33.27,0.31 33.27,7.53
$1N975: length 53
  Bottom Layer w0.254: -0.11,25.43 2.82,25.43 arc(2.84,24.09) 2.92,22.75 arc(4.51,19) 8.25,17.4 10.29,17.4 arc(10.4,17.67) 10.67,17.78 15.49,17.78 arc(15.31,17.71) 15.24,17.53 15.24,12.45 arc(15.28,12.54) 15.37,12.57 35.81,12.57 35.81,7.53 ; 2.67,22.99 arc(2.7,22.88) 2.67,22.76 arc(2.67,22.87) 2.67,22.99
$1N1014: length 59.8
  Bottom Layer w0.254: U13.2 arc(1.33,30.47) 2.67,30.48 5.21,30.23 5.21,25.53 arc(6.73,21.85) 10.41,20.32 arc(10.45,20.23) 10.54,20.19 17.91,20.19 arc(17.82,20.16) 17.78,20.07 17.78,14.86 arc(17.93,15.22) 18.29,15.37 38.35,15.37 38.35,7.5
$1N1055: length 152
  Bottom Layer w0.254: 2.79,35.56 76.82,35.56 arc(76.63,34.36) 76.58,33.15 76.58,18.29 arc(76.77,17.84) 77.22,17.65 43.33,17.65 ; 40.79,-5.18 43.46,-5.18 arc(43.53,-5.15) 43.56,-5.08 43.56,9.99 arc(43.51,13.82) 43.33,17.65 ; 43.2,17.53 arc(43.24,17.62) 43.33,17.65
$1N1864: length 21.1
  Bottom Layer w0.254: 33.27,20.19 33.27,20.31 arc(35.47,25.61) 40.77,27.8 arc(40.77,27.81) 40.78,27.81 48.51,27.81 arc(48.42,27.85) 48.39,27.94 48.39,29.18

Small or netless copper shapes (teardrops, artwork), in the pictures only: 1172 on Top Layer
